# Altium project modFOC-ESC.PrjPcb
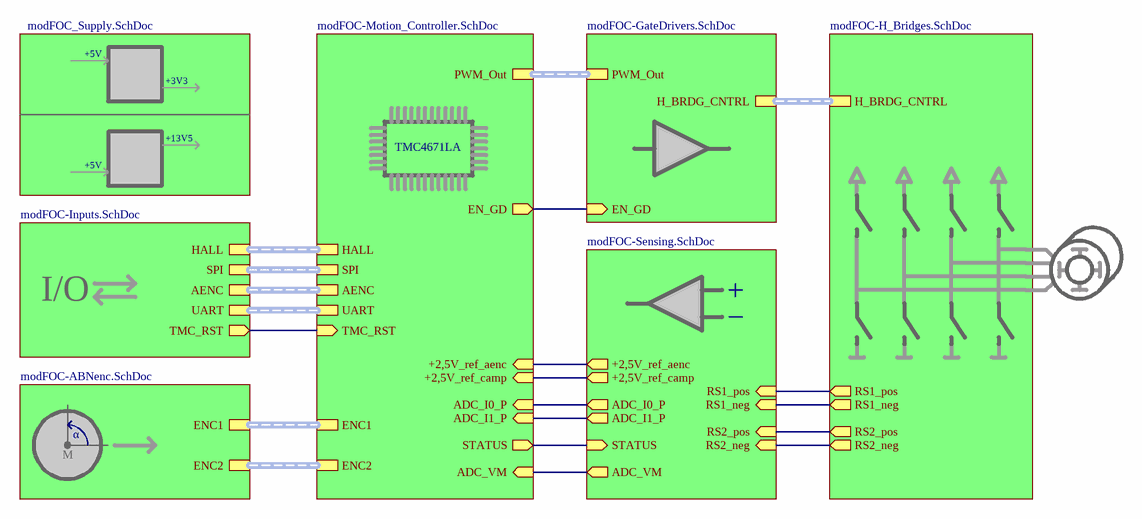
[diagram p0: modFOC-Main.SchDoc]
8 sheets, 184 parts. Net scope: hierarchical (ports join the sheet entries above them; power ports are global).
Board file: modFOC_ESC.PcbDoc
Sheets:
  modFOC-Main.SchDoc
    Motion_Controller = modFOC-Motion_Controller.SchDoc
    GateDrivers = modFOC-GateDrivers.SchDoc
    H_Bridges = modFOC-H_Bridges.SchDoc
    Inputs = modFOC-Inputs.SchDoc
    Sensing = modFOC-Sensing.SchDoc
    ABNenc = modFOC-ABNenc.SchDoc
    Supply = modFOC_Supply.SchDoc

## Sheet modFOC-Main.SchDoc: modFOC-Top
size A4; Author: Mathias Giller; CompanyName: HTL St. Pölten; Address1: modFOC; DocumentNumber: 0; Revision: 2.0; SheetNumber: 0; SheetTotal: 6

### Sub-sheets
ABNenc = modFOC-ABNenc.SchDoc: ENC1 (harness ENC1), ENC2 (harness ENC2)
GateDrivers = modFOC-GateDrivers.SchDoc: PWM_Out (harness PWM_Out), H_BRDG_CNTRL (harness H_BRDG_CNTRL), EN_GD (in)
H_Bridges = modFOC-H_Bridges.SchDoc: RS1_pos (out), RS1_neg (out), RS2_pos (out), RS2_neg (out), H_BRDG_CNTRL (harness H_BRDG_CNTRL)
Inputs = modFOC-Inputs.SchDoc: HALL (harness HALL), SPI (harness SPI), AENC (harness AENC), UART (harness UART), TMC_RST (out)
Motion_Controller = modFOC-Motion_Controller.SchDoc: PWM_Out (harness PWM_Out), ADC_I0_P (in), ADC_I1_P (in), STATUS (out), ADC_VM (in), SPI (harness SPI), UART (harness UART), +2,5V_ref_camp (in), HALL (harness HALL), ENC1 (harness ENC1), AENC (harness AENC), ENC2 (harness ENC2), EN_GD (out), TMC_RST (in), +2,5V_ref_aenc (in)
Sensing = modFOC-Sensing.SchDoc: ADC_I1_P (out), STATUS (in), RS2_neg (in), +2,5V_ref_camp (out), ADC_I0_P (out), RS2_pos (in), RS1_neg (in), ADC_VM (out), RS1_pos (in), +2,5V_ref_aenc (out)
Supply = modFOC_Supply.SchDoc: no entries

### Nets
+2,5V_ref_aenc: sheet Motion_Controller/+2,5V_ref_aenc, sheet Sensing/+2,5V_ref_aenc
+2,5V_ref_camp: sheet Motion_Controller/+2,5V_ref_camp, sheet Sensing/+2,5V_ref_camp
ADC_I0_P: sheet Motion_Controller/ADC_I0_P, sheet Sensing/ADC_I0_P
ADC_I1_P: sheet Motion_Controller/ADC_I1_P, sheet Sensing/ADC_I1_P
ADC_VM: sheet Motion_Controller/ADC_VM, sheet Sensing/ADC_VM
EN_GD: sheet Motion_Controller/EN_GD, sheet GateDrivers/EN_GD
RS1_neg: sheet H_Bridges/RS1_neg, sheet Sensing/RS1_neg
RS1_pos: sheet H_Bridges/RS1_pos, sheet Sensing/RS1_pos
RS2_neg: sheet H_Bridges/RS2_neg, sheet Sensing/RS2_neg
RS2_pos: sheet H_Bridges/RS2_pos, sheet Sensing/RS2_pos
STATUS: sheet Motion_Controller/STATUS, sheet Sensing/STATUS
TMC_RST: sheet Motion_Controller/TMC_RST, sheet Inputs/TMC_RST

### Buses and harness runs
harness sheet ABNenc/ENC1 = sheet Motion_Controller/ENC1
harness sheet ABNenc/ENC2 = sheet Motion_Controller/ENC2
harness sheet GateDrivers/H_BRDG_CNTRL = sheet H_Bridges/H_BRDG_CNTRL
harness sheet GateDrivers/PWM_Out = sheet Motion_Controller/PWM_Out
harness sheet Inputs/AENC = sheet Motion_Controller/AENC
harness sheet Inputs/HALL = sheet Motion_Controller/HALL
harness sheet Inputs/SPI = sheet Motion_Controller/SPI
harness sheet Inputs/UART = sheet Motion_Controller/UART

### Notes on the sheet
- +5V
- +3V3
- +13V5
- TMC4671LA
- I/O
- M
- α
- Title
- Size:
- Date:
- A4
- Number:
- Time:
- Revision:
- Sheet
- of
- File:

## Sheet modFOC-Motion_Controller.SchDoc: modFOC-Motion_Controller
size A4; Date: dssd; Author: Mathias Giller; CompanyName: HTL St. Pölten; Address1: modFOC; DocumentNumber: 1; Revision: 2.0; SheetNumber: 1; SheetTotal: 5
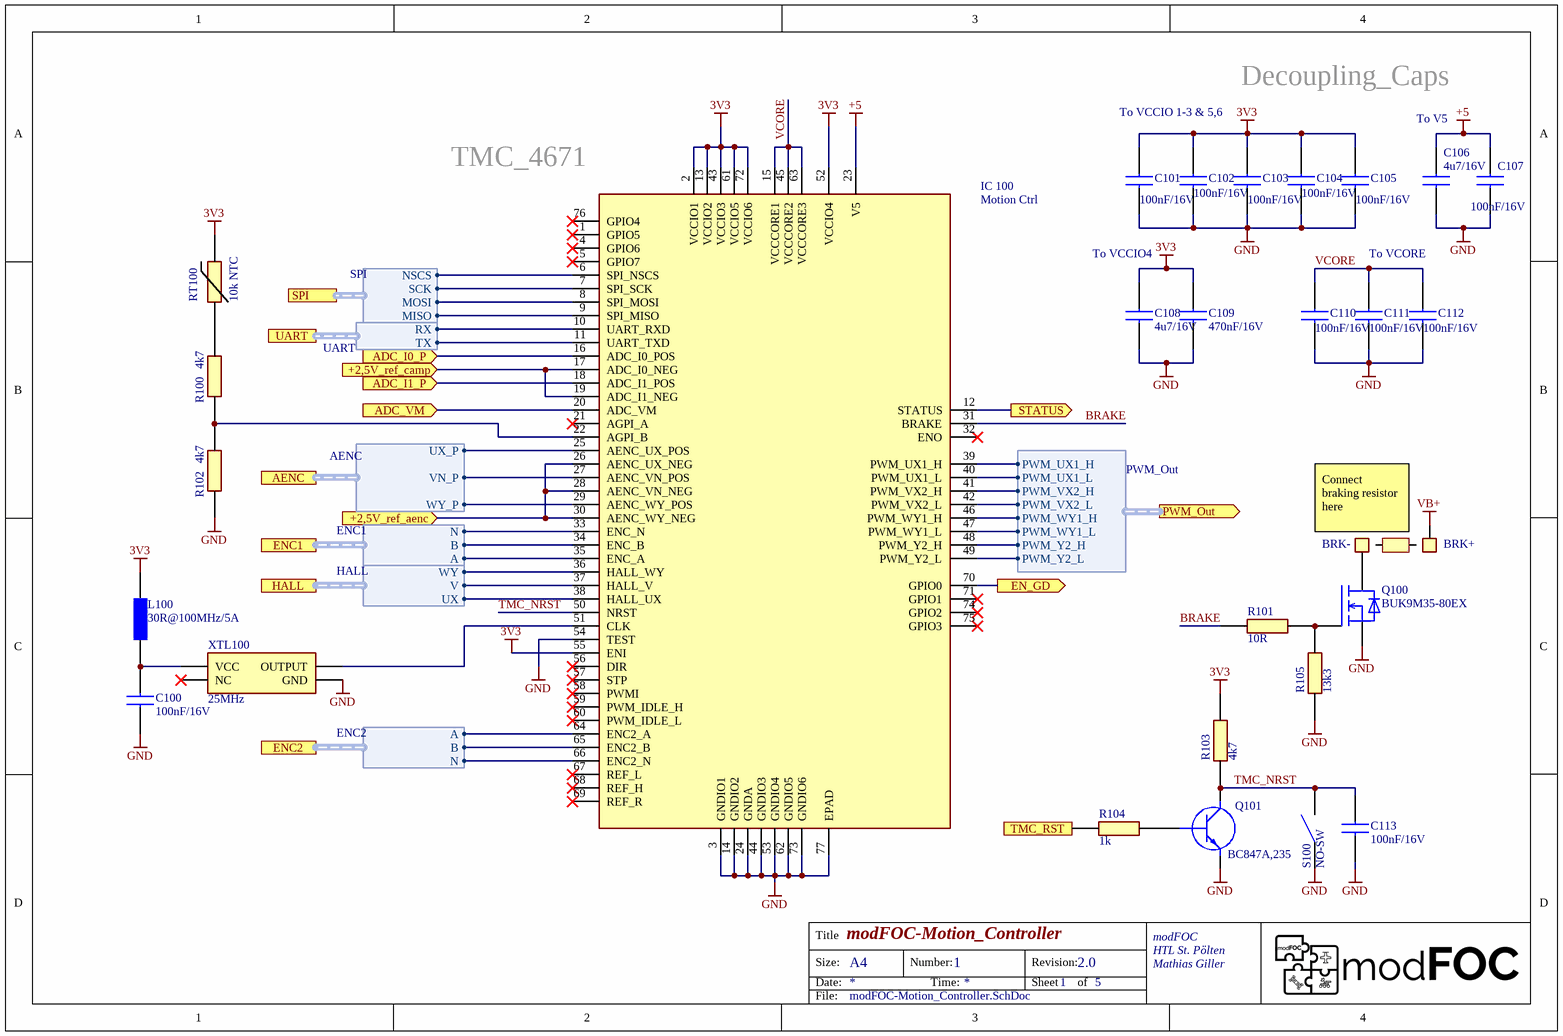
[diagram p1: modFOC-Motion_Controller.SchDoc]

### Parts
BRK+  PW_PAD_SMOL  [PW_PAD_SMOL]  (value not drawn)
BRK-  PW_PAD_SMOL  [PW_PAD_SMOL]  (value not drawn)
C100  100nF/16V  [CAPC1608X97N]
C101  100nF/16V  [CAPC1608X97N]
C102  100nF/16V  [CAPC1608X97N]
C103  100nF/16V  [CAPC1608X97N]
C104  100nF/16V  [CAPC1608X97N]
C105  100nF/16V  [CAPC1608X97N]
C106  4u7/16V  [CAPC1608X97N]
C107  100nF/16V  [CAPC1608X97N]
C108  4u7/16V  [CAPC1608X97N]
C109  470nF/16V  [CAPC1608X97N]
C110  100nF/16V  [CAPC1608X97N]
C111  100nF/16V  [CAPC1608X97N]
C112  100nF/16V  [CAPC1608X97N]
C113  100nF/16V  [CAPC1608X97N]
IC_100  Motion Ctrl  [QFN40P1050X650X90-77N]
L100  30R@100MHz/5A  [BLM18KG101TH1D]
Q100  BUK9M35-80EX  [BUK7M1260E]
Q101  BC847A,235  [SOT95P230X110-3N]
R100  4k7  [RESC1608X55N]
R101  10R  [RESC1608X55N]
R102  4k7  [RESC1608X55N]
R103  4k7  [RESC1608X55N]
R104  1k  [RESC1608X55N]
R105  13k3  [RESC1608X55N]
RT100  10k NTC  [THRMC1608X95N]
S100  NO-SW  [PTS647SM50SMTR2LFS]
XTL100  25MHz  [FOX924B25]

### Ports
+2,5V_ref_aenc (in), +2,5V_ref_camp (in), ADC_I0_P (in), ADC_I1_P (in), ADC_VM (in), AENC (harness AENC), EN_GD (out), ENC1 (harness ENC1), ENC2 (harness ENC2), HALL (harness HALL), PWM_Out (out, harness PWM_Out), SPI (harness SPI), STATUS (out), TMC_RST (in), UART (harness UART)

### Harnesses
PWM_Out: PWM_UX1_H, PWM_UX1_L, PWM_VX2_H, PWM_VX2_L, PWM_WY1_H, PWM_WY1_L, PWM_Y2_H, PWM_Y2_L
UART: RX, TX
AENC: UX_P, VN_P, WY_P
ENC1: N, B, A
HALL: WY, V, UX
ENC2: A, B, N
SPI: NSCS, SCK, MOSI, MISO

### Nets
3V3: C101.2 C102.2 C103.2 C104.2 C105.2 C108.2 C109.1 IC_100.2(VCCIO1) IC_100.13(VCCIO2) IC_100.43(VCCIO3) IC_100.52(VCCIO4) IC_100.55(ENI) IC_100.61(VCCIO5) IC_100.72(VCCIO6) L100.1 R103.2 RT100.1
+5: C106.2 C107.1 IC_100.23(V5)
GND: C100.1 C101.1 C102.1 C103.1 C104.1 C105.1 C106.1 C107.2 C108.1 C109.2 C110.2 C111.2 C112.2 C113.1 IC_100.3(GNDIO1) IC_100.14(GNDIO2) IC_100.24(GNDA) IC_100.44(GNDIO3) IC_100.53(GNDIO4) IC_100.54(TEST) IC_100.62(GNDIO5) IC_100.73(GNDIO6) IC_100.77(EPAD) Q100.1,2,3(S) Q101.2(E) R102.1 R105.2 S100.1,2 XTL100.2(GND)
VB+: BRK+.1
+2,5V_ref_aenc: IC_100.26(AENC_UX_NEG) IC_100.28(AENC_VN_NEG) IC_100.30(AENC_WY_NEG) ; port +2,5V_ref_aenc
+2,5V_ref_camp: IC_100.17(ADC_I0_NEG) IC_100.19(ADC_I1_NEG) ; port +2,5V_ref_camp
ADC_I0_P: IC_100.16(ADC_I0_POS) ; port ADC_I0_P
ADC_I1_P: IC_100.18(ADC_I1_POS) ; port ADC_I1_P
ADC_VM: IC_100.20(ADC_VM) ; port ADC_VM
BRAKE: IC_100.31(BRAKE) R101.1
EN_GD: IC_100.70(GPIO0) ; port EN_GD
SPI.MISO: IC_100.9(SPI_MISO) ; port SPI.MISO
SPI.MOSI: IC_100.8(SPI_MOSI) ; port SPI.MOSI
SPI.SCK: IC_100.7(SPI_SCK) ; port SPI.SCK
STATUS: IC_100.12(STATUS) ; port STATUS
TMC_NRST: C113.2 IC_100.50(NRST) Q101.3(C) R103.1 S100.3,4
TMC_RST: R104.2 ; port TMC_RST
UART.RX: IC_100.10(UART_RXD) ; port UART.RX
VCORE: C110.1 C111.1 C112.1 IC_100.15(VCCCORE1) IC_100.45(VCCCORE2) IC_100.63(VCCCORE3)
NetBRK-_1: BRK-.1 Q100.5,6,7,8,9(D)
NetC100_2: C100.2 L100.2 XTL100.4(VCC)
NetD203_1: IC_100.27(AENC_VN_POS) ; port AENC.VN_P
NetD203_3: IC_100.25(AENC_UX_POS) ; port AENC.UX_P
NetD203_4: IC_100.11(UART_TXD) ; port UART.TX
NetD203_6: IC_100.29(AENC_WY_POS) ; port AENC.WY_P
NetIC200_2: IC_100.38(HALL_UX) ; port HALL.UX
NetIC200_5: IC_100.37(HALL_V) ; port HALL.V
NetIC200_7: IC_100.36(HALL_WY) ; port HALL.WY
NetIC202_3: IC_100.6(SPI_NSCS) ; port SPI.NSCS
NetIC300_2: IC_100.33(ENC_N) ; port ENC1.N
NetIC300_5: IC_100.34(ENC_B) ; port ENC1.B
NetIC300_7: IC_100.35(ENC_A) ; port ENC1.A
NetIC301_2: IC_100.66(ENC2_N) ; port ENC2.N
NetIC301_5: IC_100.65(ENC2_B) ; port ENC2.B
NetIC301_7: IC_100.64(ENC2_A) ; port ENC2.A
NetIC500_7: IC_100.39(PWM_UX1_H) ; port PWM_Out.PWM_UX1_H
NetIC500_8: IC_100.40(PWM_UX1_L) ; port PWM_Out.PWM_UX1_L
NetIC501_7: IC_100.41(PWM_VX2_H) ; port PWM_Out.PWM_VX2_H
NetIC501_8: IC_100.42(PWM_VX2_L) ; port PWM_Out.PWM_VX2_L
NetIC502_7: IC_100.46(PWM_WY1_H) ; port PWM_Out.PWM_WY1_H
NetIC502_8: IC_100.47(PWM_WY1_L) ; port PWM_Out.PWM_WY1_L
NetIC503_7: IC_100.48(PWM_Y2_H) ; port PWM_Out.PWM_Y2_H
NetIC503_8: IC_100.49(PWM_Y2_L) ; port PWM_Out.PWM_Y2_L
NetIC_100_22: IC_100.22(AGPI_B) R100.1 R102.2
NetIC_100_51: IC_100.51(CLK) XTL100.3(OUTPUT)
NetQ100_4: Q100.4(G) R101.2 R105.1
NetQ101_1: Q101.1(B) R104.1
NetR100_2: R100.2 RT100.2

Not connected (* = marked no-connect by the designer): IC_100 1(GPIO5)* 4(GPIO6)* 5(GPIO7)* 21(AGPI_A)* 32(ENO)* 56(DIR)* 57(STP)* 58(PWMI)* 59(PWM_IDLE_H)* 60(PWM_IDLE_L)* 67(REF_L)* 68(REF_H)* 69(REF_R)* 71(GPIO1)* 74(GPIO2)* 75(GPIO3)* 76(GPIO4)*; XTL100 1(NC)*

### Notes on the sheet
- To VCCIO 1-3 & 5,6
- Decoupling_Caps
- (near IC_100) TMC_4671
- To V5
- To VCCIO4
- To VCORE
- Connect
  braking resistor
  here
- Title
- Size:
- Date:
- A4
- Number:
- Time:
- Revision:
- Sheet
- of
- File:

### Library data of the parts
C100-C113 = C0603: Capacitor
IC_100 = TMC4671-LA IC: FOC Motion Controller; Manufacturer_Name: Trinamic; Manufacturer_Part_Number: TMC4671-LA
L100 = BLM18KG300TH1D: Ferrite Bead; Manufacturer_Name: Murata Electronics; Datasheet Link: https://www.murata.com/en-us/products/productdetail?partno=BLM18KG300TH1%23; Height: 0.75mm; Manufacturer_Part_Number: BLM18KG300TH1D; Arrow Part Number: BLM18KG300TH1D; Arrow Price/Stock: https://www.arrow.com/en/products/blm18kg300th1d/murata-manufacturing; Mouser Part Number: 81-BLM18KG300TH1D; Mouser Price/Stock: https://www.mouser.com/Search/Refine.aspx?Keyword=81-BLM18KG300TH1D
Q100 = BUK9M35-80EX: MOSFET (N-Channel); Manufacturer_Name: Nexperia; Datasheet Link: https://assets.nexperia.com/documents/data-sheet/BUK9M35-80E.pdf; Manufacturer_Part_Number: BUK9M35-80EX; Mouser Part Number: 771-BUK9M35-80EX; Mouser Price/Stock: https://www.mouser.com/Search/Refine.aspx?Keyword=771-BUK9M35-80EX; Arrow Part Number: BUK9M35-80EX; Arrow Price/Stock: https://www.arrow.com/en/products/buk9m35-80ex/nexperia
Q101 = BC847A,235: Transistor BJT NPN; Manufacturer_Name: Nexperia; Datasheet Link: http://assets.nexperia.com/documents/data-sheet/BC847_SER.pdf; Height: 1.1mm; Manufacturer_Part_Number: BC847A,235; Mouser Part Number: 771-BC847A235; Mouser Price/Stock: https://www.mouser.co.uk/ProductDetail/Nexperia/BC847A235?qs=me8TqzrmIYWeD%252BqPzufrRA%3D%3D; Arrow Part Number: BC847A,235; Arrow Price/Stock: https://www.arrow.com/en/products/bc847a235/nexperia
R100-R105 = R0603: Resistor
RT100 = NCP18XH103F03RB: Thermistor; Manufacturer_Name: Murata Electronics; Datasheet Link: https://componentsearchengine.com/Datasheets/2/NCP18XH103F03RB.pdf; Height: 0.95mm; Manufacturer_Part_Number: NCP18XH103F03RB; Mouser Part Number: 81-NCP18XH103F03RB; Mouser Price/Stock: https://www.mouser.co.uk/ProductDetail/Murata-Electronics/NCP18XH103F03RB?qs=k3rQb2PKXqkF9YvF09qsvw%3D%3D; Arrow Part Number: NCP18XH103F03RB; Arrow Price/Stock: https://www.arrow.com/en/products/ncp18xh103f03rb/murata-manufacturing?region=europe
S100 = PTS647SM50SMTR2LFS: Switch; Manufacturer_Name: C & K COMPONENTS; Datasheet Link: https://www.ckswitches.com/media/2567/pts647.pdf; Height: 5.25mm; Manufacturer_Part_Number: PTS647SM50SMTR2LFS; Mouser Part Number: 611-PTS647SM50SMTR2L; Mouser Price/Stock: https://www.mouser.co.uk/ProductDetail/CK/PTS647SM50SMTR2LFS?qs=PqoDHHvF64%252BjK4ZB7f42kw%3D%3D; Arrow Part Number: PTS647SM50SMTR2LFS; Arrow Price/Stock: https://www.arrow.com/en/products/pts-647-sm50-smtr2-lfs/ck?region=nac
XTL100 = FOX924B-25: 25Mhz Oscillator; Manufacturer_Name: FOX; Manufacturer_Part_Number: FOX924B-25

## Sheet modFOC-GateDrivers.SchDoc: modFOC-GateDrivers
size A4; Author: Mathias Giller; CompanyName: HTL St. Pölten; Address1: modFOC; DocumentNumber: 5; Revision: 2.0; SheetNumber: 5; SheetTotal: 7
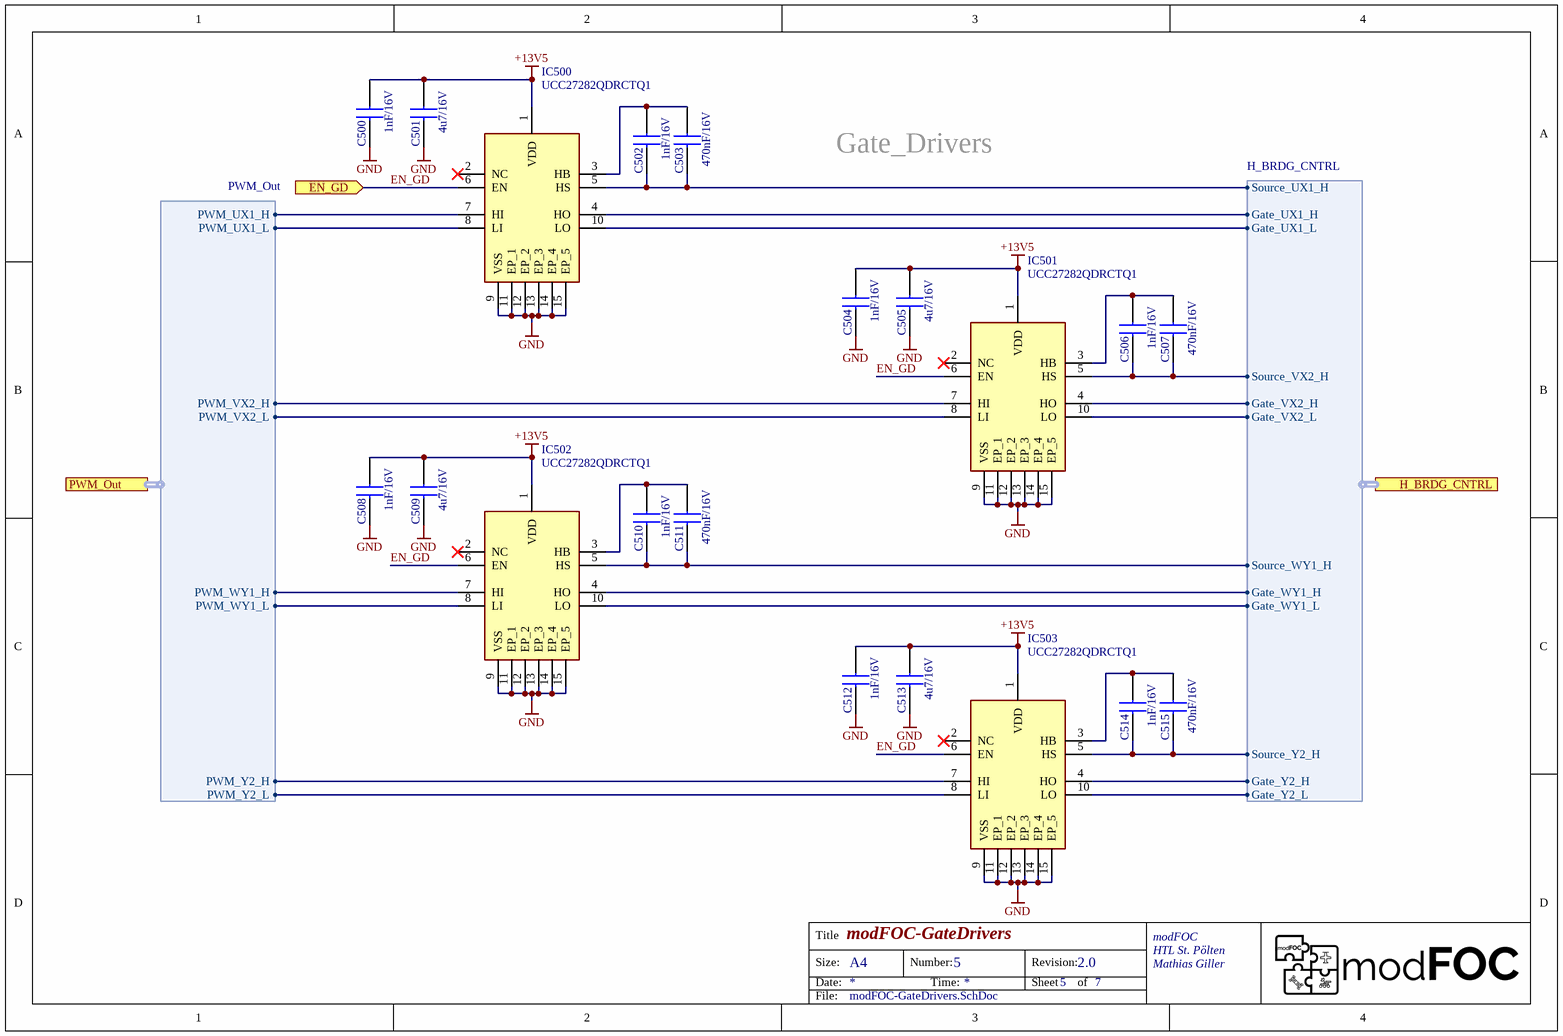
[diagram p2: modFOC-GateDrivers.SchDoc]

### Parts
C500  1nF/16V  [CAPC1608X97N]
C501  4u7/16V  [CAPC1608X97N]
C502  1nF/16V  [CAPC1608X97N]
C503  470nF/16V  [CAPC1608X97N]
C504  1nF/16V  [CAPC1608X97N]
C505  4u7/16V  [CAPC1608X97N]
C506  1nF/16V  [CAPC1608X97N]
C507  470nF/16V  [CAPC1608X97N]
C508  1nF/16V  [CAPC1608X97N]
C509  4u7/16V  [CAPC1608X97N]
C510  1nF/16V  [CAPC1608X97N]
C511  470nF/16V  [CAPC1608X97N]
C512  1nF/16V  [CAPC1608X97N]
C513  4u7/16V  [CAPC1608X97N]
C514  1nF/16V  [CAPC1608X97N]
C515  470nF/16V  [CAPC1608X97N]
IC500  UCC27282QDRCTQ1  [UCC27282DRCR]
IC501  UCC27282QDRCTQ1  [UCC27282DRCR]
IC502  UCC27282QDRCTQ1  [UCC27282DRCR]
IC503  UCC27282QDRCTQ1  [UCC27282DRCR]

### Ports
EN_GD (in), H_BRDG_CNTRL (harness H_BRDG_CNTRL), PWM_Out (harness PWM_Out)

### Harnesses
PWM_Out: PWM_UX1_H, PWM_UX1_L, PWM_VX2_H, PWM_VX2_L, PWM_WY1_H, PWM_WY1_L, PWM_Y2_L, PWM_Y2_H
H_BRDG_CNTRL: Gate_UX1_H, Source_UX1_H, Gate_UX1_L, Source_VX2_H, Gate_VX2_H, Gate_VX2_L, Source_WY1_H, Gate_WY1_H, Gate_WY1_L, Source_Y2_H, Gate_Y2_H, Gate_Y2_L

### Nets
+13V5: C500.2 C501.2 C504.2 C505.2 C508.2 C509.2 C512.2 C513.2 IC500.1(VDD) IC501.1(VDD) IC502.1(VDD) IC503.1(VDD)
GND: C500.1 C501.1 C504.1 C505.1 C508.1 C509.1 C512.1 C513.1 IC500.9(VSS) IC500.11(EP_1) IC500.12(EP_2) IC500.13(EP_3) IC500.14(EP_4) IC500.15(EP_5) IC501.9(VSS) IC501.11(EP_1) IC501.12(EP_2) IC501.13(EP_3) IC501.14(EP_4) IC501.15(EP_5) IC502.9(VSS) IC502.11(EP_1) IC502.12(EP_2) IC502.13(EP_3) IC502.14(EP_4) IC502.15(EP_5) IC503.9(VSS) IC503.11(EP_1) IC503.12(EP_2) IC503.13(EP_3) IC503.14(EP_4) IC503.15(EP_5)
EN_GD: IC500.6(EN) IC501.6(EN) IC502.6(EN) IC503.6(EN) ; port EN_GD
NetC502_1: C502.1 C503.1 IC500.5(HS) ; port H_BRDG_CNTRL.Source_UX1_H
NetC502_2: C502.2 C503.2 IC500.3(HB)
NetC506_1: C506.1 C507.1 IC501.5(HS) ; port H_BRDG_CNTRL.Source_VX2_H
NetC506_2: C506.2 C507.2 IC501.3(HB)
NetC510_1: C510.1 C511.1 IC502.5(HS) ; port H_BRDG_CNTRL.Source_WY1_H
NetC510_2: C510.2 C511.2 IC502.3(HB)
NetC514_1: C514.1 C515.1 IC503.5(HS) ; port H_BRDG_CNTRL.Source_Y2_H
NetC514_2: C514.2 C515.2 IC503.3(HB)
NetIC500_4: IC500.4(HO) ; port H_BRDG_CNTRL.Gate_UX1_H
NetIC500_7: IC500.7(HI) ; port PWM_Out.PWM_UX1_H
NetIC500_8: IC500.8(LI) ; port PWM_Out.PWM_UX1_L
NetIC500_10: IC500.10(LO) ; port H_BRDG_CNTRL.Gate_UX1_L
NetIC501_4: IC501.4(HO) ; port H_BRDG_CNTRL.Gate_VX2_H
NetIC501_7: IC501.7(HI) ; port PWM_Out.PWM_VX2_H
NetIC501_8: IC501.8(LI) ; port PWM_Out.PWM_VX2_L
NetIC501_10: IC501.10(LO) ; port H_BRDG_CNTRL.Gate_VX2_L
NetIC502_4: IC502.4(HO) ; port H_BRDG_CNTRL.Gate_WY1_H
NetIC502_7: IC502.7(HI) ; port PWM_Out.PWM_WY1_H
NetIC502_8: IC502.8(LI) ; port PWM_Out.PWM_WY1_L
NetIC502_10: IC502.10(LO) ; port H_BRDG_CNTRL.Gate_WY1_L
NetIC503_4: IC503.4(HO) ; port H_BRDG_CNTRL.Gate_Y2_H
NetIC503_7: IC503.7(HI) ; port PWM_Out.PWM_Y2_H
NetIC503_8: IC503.8(LI) ; port PWM_Out.PWM_Y2_L
NetIC503_10: IC503.10(LO) ; port H_BRDG_CNTRL.Gate_Y2_L

Not connected (* = marked no-connect by the designer): IC500 2(NC)*; IC501 2(NC)*; IC502 2(NC)*; IC503 2(NC)*

### Notes on the sheet
- Gate_Drivers
- Title
- Size:
- Date:
- A4
- Number:
- Time:
- Revision:
- Sheet
- of
- File:

### Library data of the parts
C500-C515 = C0603: Capacitor
IC500-IC503 = UCC27282QDRCTQ1: Halfbridge driver IC; Manufacturer_Name: Texas Instruments; Datasheet Link: https://www.ti.com/lit/ds/symlink/ucc27282.pdf?ts=1615361050656&ref_url=https%253A%252F%252Fwww.ti.com%252Fstore%252Fti%252Fen%252Fp%252Fproduct%252F%253Fp%253DUCC27282DRCR; Height: 1mm; Manufacturer_Part_Number: UCC27282QDRCTQ1; Mouser Part Number: 595-UCC27282DRCR; Mouser Price/Stock: https://www.mouser.co.uk/ProductDetail/Texas-Instruments/UCC27282DRCR?qs=PqoDHHvF64%252BEqc2WJXKXkQ%3D%3D; Arrow Part Number: UCC27282DRCR; Arrow Price/Stock: https://www.arrow.com/en/products/ucc27282drcr/texas-instruments?region=nac

## Sheet modFOC-H_Bridges.SchDoc: modFOC-H-Bridges
size A4; Author: Mathias Giller; CompanyName: HTL St. Pölten; Address1: modFOC; DocumentNumber: 6; Revision: 2.0; SheetNumber: 6; SheetTotal: 7
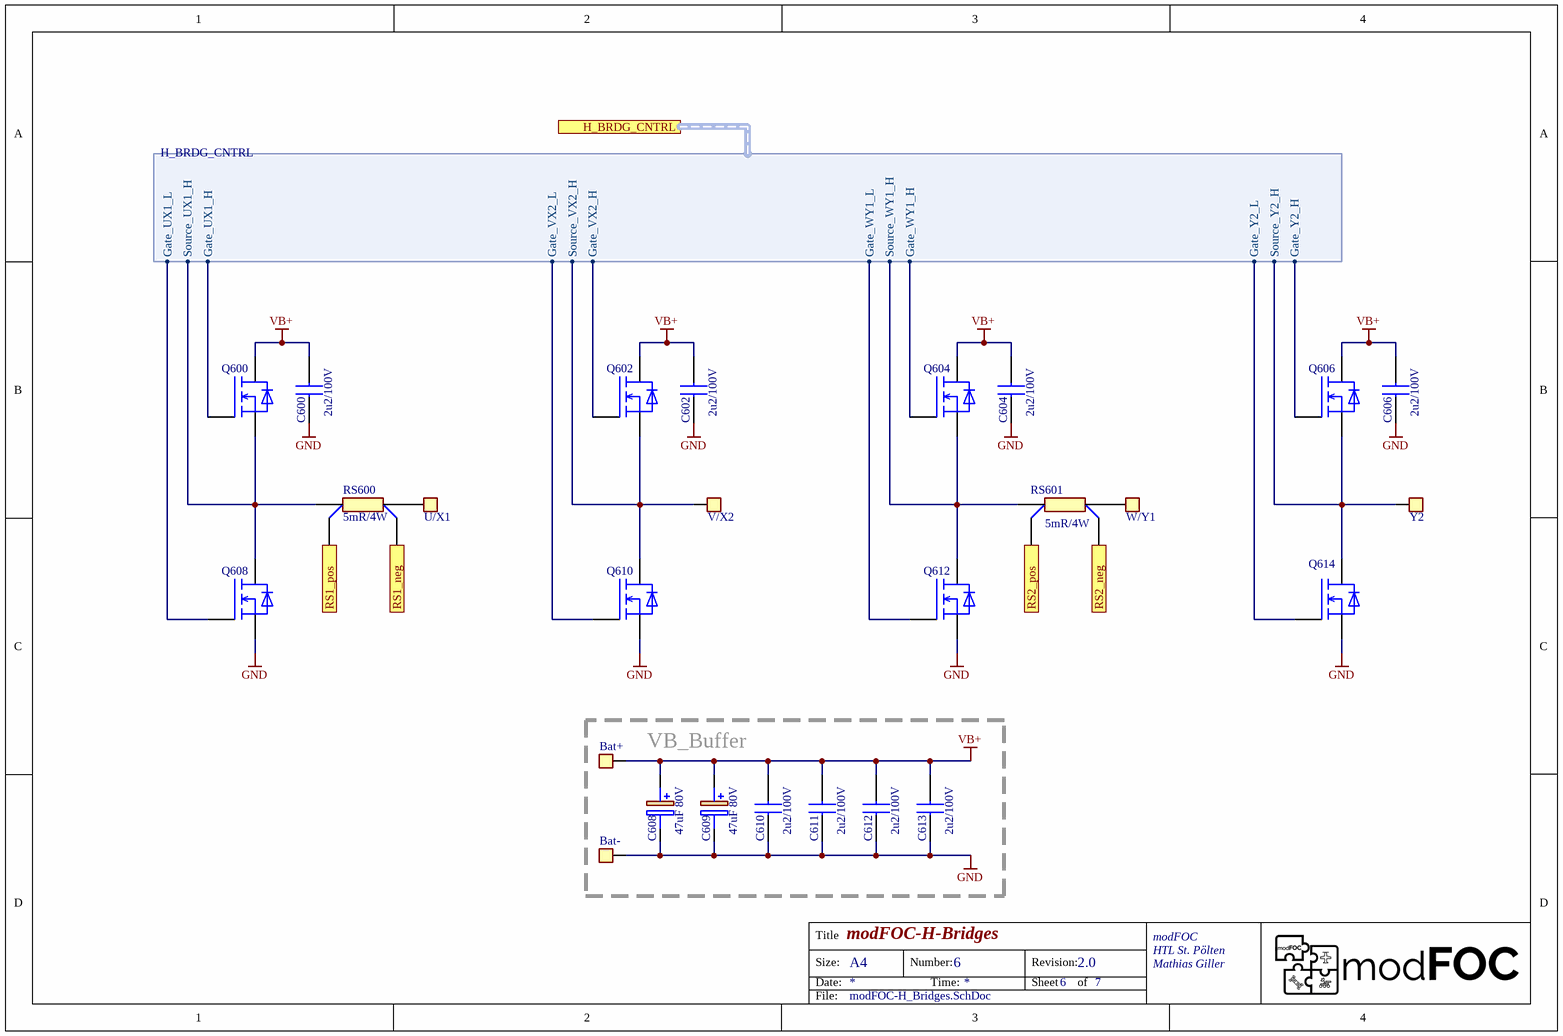
[diagram p3: modFOC-H_Bridges.SchDoc]

### Parts
Bat+  PowerPad  [POWER_PAD]  (value not drawn)
Bat-  PowerPad  [POWER_PAD]  (value not drawn)
C600  2u2/100V  [CAPC3225X280N]
C602  2u2/100V  [CAPC3225X280N]
C604  2u2/100V  [CAPC3225X280N]
C606  2u2/100V  [CAPC3225X280N]
C608  47uF 80V  [CAPAE1050X1050N]
C609  47uF 80V  [CAPAE1050X1050N]
C610  2u2/100V  [CAPC3225X280N]
C611  2u2/100V  [CAPC3225X280N]
C612  2u2/100V  [CAPC3225X280N]
C613  2u2/100V  [CAPC3225X280N]
Q600  80V/100A  [SI7141DPT1GE3]  (value not drawn)
Q602  80V/100A  [SI7141DPT1GE3]  (value not drawn)
Q604  80V/100A  [SI7141DPT1GE3]  (value not drawn)
Q606  80V/100A  [SI7141DPT1GE3]  (value not drawn)
Q608  80V/100A  [SI7141DPT1GE3]  (value not drawn)
Q610  80V/100A  [SI7141DPT1GE3]  (value not drawn)
Q612  80V/100A  [SI7141DPT1GE3]  (value not drawn)
Q614  80V/100A  [SI7141DPT1GE3]  (value not drawn)
RS600  5mR/4W  [FC4L90R025FER]
RS601  5mR/4W  [FC4L90R025FER]
U/X1  PowerPad  [POWER_PAD]  (value not drawn)
V/X2  PowerPad  [POWER_PAD]  (value not drawn)
W/Y1  PowerPad  [POWER_PAD]  (value not drawn)
Y2  PowerPad  [POWER_PAD]  (value not drawn)

### Blocks framed on the sheet
VB_Buffer: Bat+ Bat- C608-C613

### Ports
H_BRDG_CNTRL (harness H_BRDG_CNTRL), RS1_neg (out), RS1_pos (out), RS2_neg (out), RS2_pos (out)

### Harnesses
H_BRDG_CNTRL: Gate_UX1_H, Source_UX1_H, Gate_UX1_L, Source_VX2_H, Gate_VX2_H, Gate_VX2_L, Source_WY1_H, Gate_WY1_H, Gate_WY1_L, Source_Y2_H, Gate_Y2_H, Gate_Y2_L

### Nets
GND: Bat-.1 C600.1 C602.1 C604.1 C606.1 C608.2(-) C609.2(-) C610.1 C611.1 C612.1 C613.1 Q608.1,2,3(S) Q610.1,2,3(S) Q612.1,2,3(S) Q614.1,2,3(S)
VB+: Bat+.1 C600.2 C602.2 C604.2 C606.2 C608.1(+) C609.1(+) C610.2 C611.2 C612.2 C613.2 Q600.11,10,9,8,7,6,5(D) Q602.11,10,9,8,7,6,5(D) Q604.11,10,9,8,7,6,5(D) Q606.11,10,9,8,7,6,5(D)
RS1_neg: RS600.1(K1) ; port RS1_neg
RS1_pos: RS600.4(K2) ; port RS1_pos
RS2_neg: RS601.4(K2) ; port RS2_neg
RS2_pos: RS601.1(K1) ; port RS2_pos
NetC502_1: Q600.1,2,3(S) Q608.11,10,9,8,7,6,5(D) RS600.3(P2) ; port H_BRDG_CNTRL.Source_UX1_H
NetC506_1: Q602.1,2,3(S) Q610.11,10,9,8,7,6,5(D) V/X2.1 ; port H_BRDG_CNTRL.Source_VX2_H
NetC510_1: Q604.1,2,3(S) Q612.11,10,9,8,7,6,5(D) RS601.2(P1) ; port H_BRDG_CNTRL.Source_WY1_H
NetC514_1: Q606.1,2,3(S) Q614.11,10,9,8,7,6,5(D) Y2.1 ; port H_BRDG_CNTRL.Source_Y2_H
NetIC500_4: Q600.4(G) ; port H_BRDG_CNTRL.Gate_UX1_H
NetIC500_10: Q608.4(G) ; port H_BRDG_CNTRL.Gate_UX1_L
NetIC501_4: Q602.4(G) ; port H_BRDG_CNTRL.Gate_VX2_H
NetIC501_10: Q610.4(G) ; port H_BRDG_CNTRL.Gate_VX2_L
NetIC502_4: Q604.4(G) ; port H_BRDG_CNTRL.Gate_WY1_H
NetIC502_10: Q612.4(G) ; port H_BRDG_CNTRL.Gate_WY1_L
NetIC503_4: Q606.4(G) ; port H_BRDG_CNTRL.Gate_Y2_H
NetIC503_10: Q614.4(G) ; port H_BRDG_CNTRL.Gate_Y2_L
NetRS600_2: RS600.2(P1) U/X1.1
NetRS601_3: RS601.3(P2) W/Y1.1

### Notes on the sheet
- Title
- Size:
- Date:
- A4
- Number:
- Time:
- Revision:
- Sheet
- of
- File:

### Library data of the parts
C600 C602 C604 C606 C610-C613 = C1210: Capacitor
C608 C609 = MAL215097701E3: ELKO 10x10x10; Manufacturer_Name: Vishay; Datasheet Link: https://www.vishay.com/docs/28395/150crz.pdf; Height: 10.5mm; Manufacturer_Part_Number: MAL215097701E3; Mouser Part Number: 594-MAL215097701E3; Mouser Price/Stock: https://www.mouser.co.uk/ProductDetail/Vishay-BC-Components/MAL215097701E3?qs=bKenfurwlsnF8zBng3kToA%3D%3D
Q600 Q602 Q604 Q606 Q608 Q610 Q612 Q614 = SIR680DP-T1-RE3: MOSFET (N-Channel); Manufacturer_Name: Vishay; Datasheet Link: https://www.vishay.com/docs/75267/sir680dp.pdf; Height: 1.12mm; Manufacturer_Part_Number: SIR680DP-T1-RE3; Mouser Part Number: 78-SIR680DP-T1-RE3; Mouser Price/Stock: https://www.mouser.co.uk/ProductDetail/Vishay-Siliconix/SIR680DP-T1-RE3?qs=Mv7BduZupUi1ZFscSbHz5g%3D%3D; Arrow Part Number: SIR680DP-T1-RE3; Arrow Price/Stock: https://www.arrow.com/en/products/sir680dp-t1-re3/vishay
RS600 RS601 = FC4L90R025FER: Resistor; Manufacturer_Name: Ohmite; Datasheet Link: https://componentsearchengine.com/Datasheets/1/FC4L90R025FER.pdf; Height: 0.8mm; Manufacturer_Part_Number: FC4L90R025FER; Mouser Part Number: 588-FC4L90R025FER; Mouser Price/Stock: https://www.mouser.co.uk/ProductDetail/Ohmite/FC4L90R025FER?qs=lc2O%252BfHJPVauiFLZwCqH8Q%3D%3D

## Sheet modFOC-Inputs.SchDoc: modFOC-Inputs
size A4; Author: Mathias Giller; CompanyName: HTL St. Pölten; Address1: modFOC; DocumentNumber: 2; Revision: 2.0; SheetNumber: 2; SheetTotal: 7
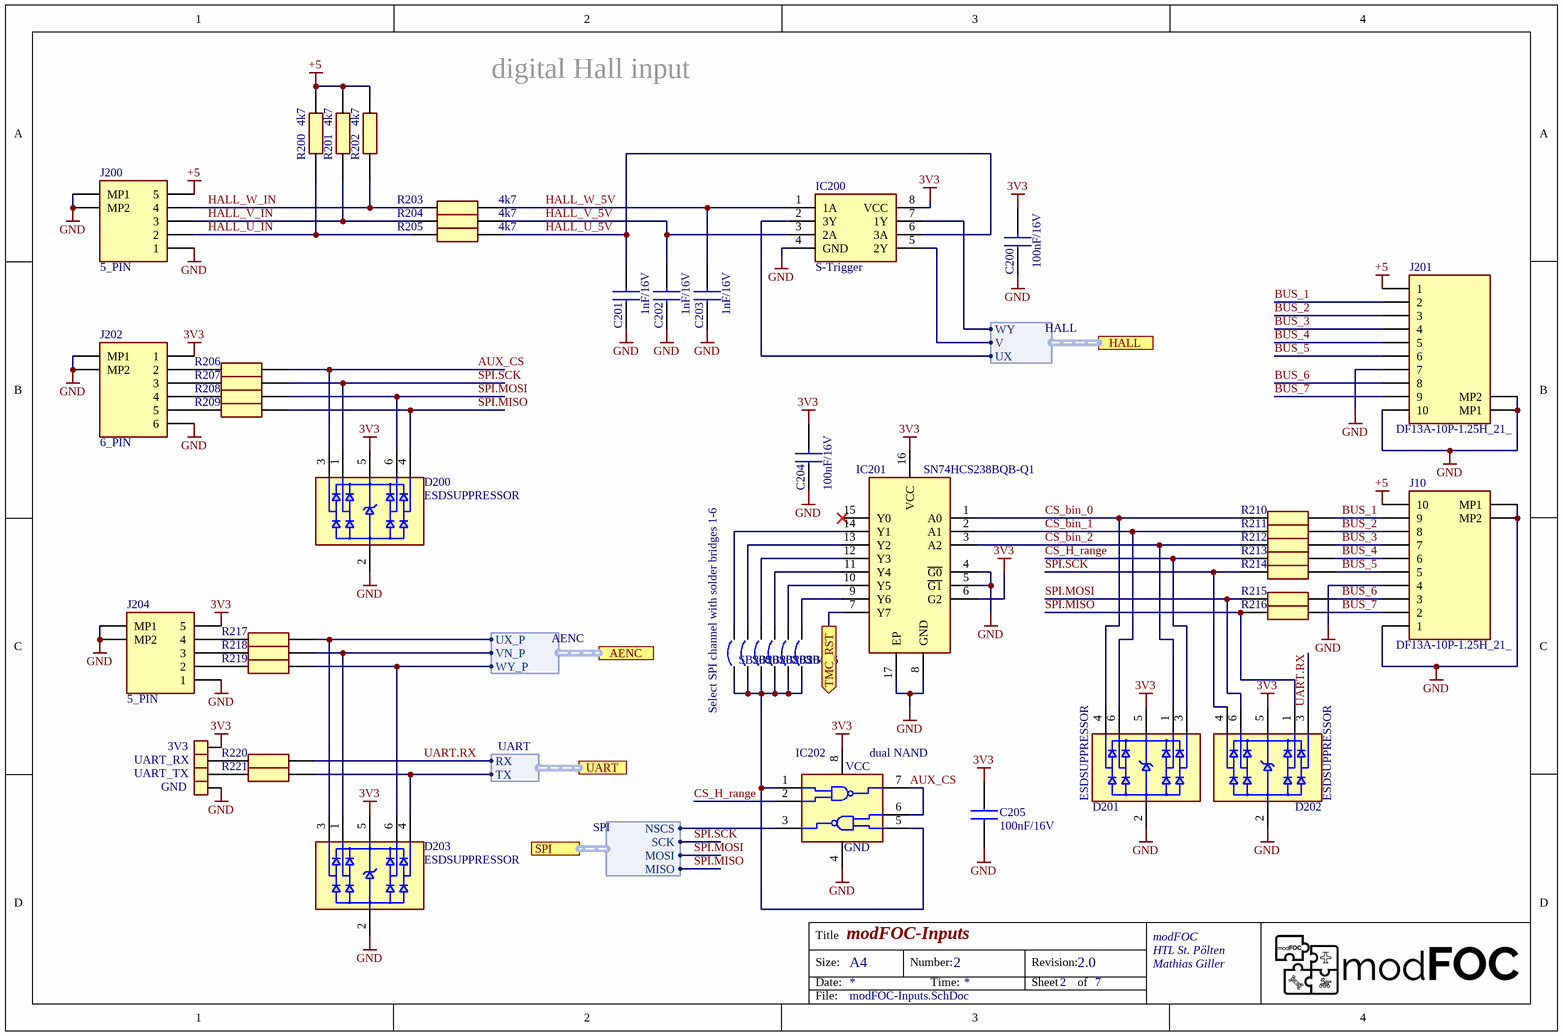
[diagram p4: modFOC-Inputs.SchDoc]

### Parts
C200  100nF/16V  [CAPC1608X97N]
C201  1nF/16V  [CAPC1608X97N]
C202  1nF/16V  [CAPC1608X97N]
C203  1nF/16V  [CAPC1608X97N]
C204  100nF/16V  [CAPC1608X97N]
C205  100nF/16V  [CAPC1608X97N]
D200  ESDSUPPRESSOR  [SOT23-6]
D201  ESDSUPPRESSOR  [SOT23-6]
D202  ESDSUPPRESSOR  [SOT23-6]
D203  ESDSUPPRESSOR  [SOT23-6]
IC200  S-Trigger  [SOP65P400X110-8N]
IC201  SN74HCS238BQB-Q1  [SN74HCS238BQB-Q1]
IC202  dual NAND  [74AUP1G74GF115]
J10  DF13A-10P-1.25H_21_  [DF13A10P125H21]
J200  5_PIN  [DF13A5P125H21]
J201  DF13A-10P-1.25H_21_  [DF13A10P125H21]
J202  6_PIN  [DF13A6P125H21]
J204  5_PIN  [DF13A5P125H21]
J205  3V3  [Pin]
J206  UART_RX  [Pin]
J207  UART_TX  [Pin]
J208  GND  [Pin]
R200  4k7  [RESC1608X55N]
R201  4k7  [RESC1608X55N]
R202  4k7  [RESC1608X55N]
R203  4k7  [RESC1608X55N]
R204  4k7  [RESC1608X55N]
R205  4k7  [RESC1608X55N]
R206  100R  [RESC1005X40N]  (value not drawn)
R207  100R  [RESC1005X40N]  (value not drawn)
R208  100R  [RESC1005X40N]  (value not drawn)
R209  100R  [RESC1005X40N]  (value not drawn)
R210  100R  [RESC1005X40N]  (value not drawn)
R211  100R  [RESC1005X40N]  (value not drawn)
R212  100R  [RESC1005X40N]  (value not drawn)
R213  100R  [RESC1005X40N]  (value not drawn)
R214  100R  [RESC1005X40N]  (value not drawn)
R215  100R  [RESC1005X40N]  (value not drawn)
R216  100R  [RESC1005X40N]  (value not drawn)
R217  100R  [RESC1005X40N]  (value not drawn)
R218  100R  [RESC1005X40N]  (value not drawn)
R219  100R  [RESC1005X40N]  (value not drawn)
R220  100R  [RESC1005X40N]  (value not drawn)
R221  100R  [RESC1005X40N]  (value not drawn)
SB200  Solder Bridge  [SOLDER-BRIDGE_R0603-0R]  (value not drawn)
SB201  Solder Bridge  [SOLDER-BRIDGE_R0603-0R]  (value not drawn)
SB202  Solder Bridge  [SOLDER-BRIDGE_R0603-0R]  (value not drawn)
SB203  Solder Bridge  [SOLDER-BRIDGE_R0603-0R]  (value not drawn)
SB204  Solder Bridge  [SOLDER-BRIDGE_R0603-0R]  (value not drawn)
SB205  Solder Bridge  [SOLDER-BRIDGE_R0603-0R]  (value not drawn)

### Ports
AENC (harness AENC), HALL (harness HALL), SPI (harness SPI), TMC_RST (out), UART (harness UART)

### Harnesses
UART: RX, TX
SPI: NSCS, SCK, MOSI, MISO
AENC: UX_P, VN_P, WY_P
HALL: WY, V, UX

### Nets
3V3: C200.2 C204.1 C205.1 D200.5(VDD) D201.5(VDD) D202.5(VDD) D203.5(VDD) IC200.8(VCC) IC201.6(G2) IC201.16(VCC) IC202.8 J202.1 J204.5 J205.1
+5: J10.10 J200.5 J201.1 R200.2 R201.2 R202.2
GND: C200.1 C201.2 C202.2 C203.2 C204.2 C205.2 D200.2(GND) D201.2(GND) D202.2(GND) D203.2(GND) IC200.4(GND) IC201.4(~{G0}) IC201.5(~{G1}) IC201.8(GND) IC201.17(EP) IC202.4 J10.1 J10.4 J10.MP1 J10.MP2 J200.1 J200.MP1 J200.MP2 J201.7 J201.10 J201.MP1 J201.MP2 J202.6 J202.MP1 J202.MP2 J204.1 J204.MP1 J204.MP2 J208.1
AUX_CS: D200.3(CH1) IC202.6(2B) IC202.7(1Y) R206.2
BUS_1: J10.9 J201.2 R210.2
BUS_2: J10.8 J201.3 R211.2
BUS_3: J10.7 J201.4 R212.2
BUS_4: J10.6 J201.5 R213.2
BUS_5: J10.5 J201.6 R214.2
BUS_6: J10.3 J201.8 R215.2
BUS_7: J10.2 J201.9 R216.2
CS_bin_0: D201.4(CH3) IC201.1(A0) R210.1
CS_bin_1: D201.6(CH2) IC201.2(A1) R211.1
CS_bin_2: D201.1(CH4) IC201.3(A2) R212.1
CS_H_range: D201.3(CH1) IC202.2(1B) R213.1
HALL_U_5V: C201.1 IC200.6(3A) R205.1
HALL_U_IN: J200.2 R200.1 R205.2
HALL_V_5V: C202.1 IC200.3(2A) R204.1
HALL_V_IN: J200.3 R201.1 R204.2
HALL_W_5V: C203.1 IC200.1(1A) R203.1
HALL_W_IN: J200.4 R202.1 R203.2
SPI.MISO: D200.4(CH3) D202.1(CH4) R209.2 R216.1 ; port SPI.MISO
SPI.MOSI: D200.6(CH2) D202.6(CH2) R208.2 R215.1 ; port SPI.MOSI
SPI.SCK: D200.1(CH4) D202.4(CH3) R207.2 R214.1 ; port SPI.SCK
TMC_RST: IC201.7(Y7) ; port TMC_RST
UART.RX: D202.3(CH1) R220.2 ; port UART.RX
NetD203_1: D203.1(CH4) R218.2 ; port AENC.VN_P
NetD203_3: D203.3(CH1) R217.2 ; port AENC.UX_P
NetD203_4: D203.4(CH3) R221.2 ; port UART.TX
NetD203_6: D203.6(CH2) R219.2 ; port AENC.WY_P
NetIC200_2: IC200.2(3Y) ; port HALL.UX
NetIC200_5: IC200.5(2Y) ; port HALL.V
NetIC200_7: IC200.7(1Y) ; port HALL.WY
NetIC201_9: IC201.9(Y6) SB205.2
NetIC201_10: IC201.10(Y5) SB204.2
NetIC201_11: IC201.11(Y4) SB203.2
NetIC201_12: IC201.12(Y3) SB202.2
NetIC201_13: IC201.13(Y2) SB201.2
NetIC201_14: IC201.14(Y1) SB200.2
NetIC202_1: IC202.1(1A) IC202.5(2A) SB200.1 SB201.1 SB202.1 SB203.1 SB204.1 SB205.1
NetIC202_3: IC202.3(2Y) ; port SPI.NSCS
NetJ202_2: J202.2 R206.1
NetJ202_3: J202.3 R207.1
NetJ202_4: J202.4 R208.1
NetJ202_5: J202.5 R209.1
NetJ204_2: J204.2 R219.1
NetJ204_3: J204.3 R218.1
NetJ204_4: J204.4 R217.1
NetJ206_1: J206.1 R220.1
NetJ207_1: J207.1 R221.1

Not connected (* = marked no-connect by the designer): IC201 15(Y0)*

### Notes on the sheet
- digital Hall input
- (near SB200) Select SPI channel with solder bridges 1-6
- Title
- Size:
- Date:
- A4
- Number:
- Time:
- Revision:
- Sheet
- of
- File:
- (in symbol 74AUP2G132GF,115) VCC; GND

### Library data of the parts
C200-C205 = C0603: Capacitor
D200-D203 = ESDSUPPRESSOR: TVS Diode (Uni-directional); Datasheet Link: *; Height: 0.6mm; Manufacturer_Name: *; Manufacturer_Part_Number: *; Mauser_Part_Number: *
IC200 = 74LVC3G17DP,125: 3x Schmitt trigger; Manufacturer_Name: Nexperia; Datasheet Link: https://assets.nexperia.com/documents/data-sheet/74LVC3G17.pdf; Height: 1.1mm; Manufacturer_Part_Number: 74LVC3G17DP,125; Mouser Part Number: 771-LVC3G17DP125; Mouser Price/Stock: https://www.mouser.co.uk/ProductDetail/Nexperia/74LVC3G17DP125?qs=me8TqzrmIYUUngWcw0uHGA%3D%3D; Arrow Part Number: 74LVC3G17DP,125; Arrow Price/Stock: https://www.arrow.com/en/products/74lvc3g17dp125/nexperia
IC201 = SN74HCS238BQB-Q1: 3bit bin to dec noninverting; Manufacturer_Name: Texas Instruments; Manufacturer_Part_Number: SN74HCS238QBQBRQ1; Datasheet Link: https://www.ti.com/lit/gpn/SN74HCS238-Q1; Height: 0.8mm; Mouser Part Number: 595-N74HCS238QBQBRQ1
IC202 = 74AUP2G132GF,115: Dual triple input NAND; Manufacturer_Name: Nexperia; Datasheet Link: https://assets.nexperia.com/documents/data-sheet/74AUP2G132.pdf; Manufacturer_Part_Number: 74AUP2G132GF,115; Mouser Part Number: 771-74AUP2G132GF115; Mouser Price/Stock: https://www.mouser.co.uk/ProductDetail/Nexperia/74AUP2G132GF115?qs=jquClx72t9AzfoBXotQVdg%3D%3D
J10 J201 = DF13A-10P-1.25H_21_: 10Pin DF13 Connector; Manufacturer_Name: Hirose; Manufacturer_Part_Number: DF13A-10P-1.25H(21); Datasheet Link: https://datasheet.datasheetarchive.com/originals/dk/DKDS-30/590349.pdf; Height: 3.75mm; Mouser Part Number: 798-DF13A10P125H21; Mouser Price/Stock: https://www.mouser.co.uk/ProductDetail/Hirose-Connector/DF13A-10P-125H21?qs=XQjbzJWzFPV7pEVOeMnY%2FQ%3D%3D; Arrow Part Number: DF13A-10P-1.25H(21); Arrow Price/Stock: https://www.arrow.com/en/products/df13a-10p-1.25h-21/hirose-electric
J200 J204 = DF13A-5P-1.25H_21_: Connector; Manufacturer_Name: Hirose; Manufacturer_Part_Number: DF13A-5P-1.25H(21); Datasheet Link: https://componentsearchengine.com/Datasheets/1/DF13A-5P-1.25H(21).pdf; Height: 3.75mm; Mouser Part Number: 798-DF13A5P125H21; Mouser Price/Stock: https://www.mouser.co.uk/ProductDetail/Hirose-Connector/DF13A-5P-125H21?qs=XQjbzJWzFPWvJsE2o%252B4Q8Q%3D%3D
J202 = DF13A-6P-1.25H_21_: 6 Pin DF13 Connector; Manufacturer_Name: Hirose; Manufacturer_Part_Number: DF13A-6P-1.25H(21); Datasheet Link: https://www.hirose.com/product/download/?distributor=digikey&type=2d&lang=en&num=DF13A-6P-1.25H(21); Height: 3.75mm; Mouser Part Number: 798-DF13A6P125H21; Mouser Price/Stock: https://www.mouser.co.uk/ProductDetail/Hirose-Connector/DF13A-6P-125H21?qs=XQjbzJWzFPXnreVi%252BPl0Lg%3D%3D; Arrow Part Number: DF13A-6P-1.25H(21); Arrow Price/Stock: https://www.arrow.com/en/products/df13a-6p-1.25h-21/hirose-electric
J205-J208 = Pin
R200-R205 = R0603: Resistor
R206-R221 = R0402: Resistor; Height: 0.4mm
SB200-SB205 = Solder Bridge: Internal_Part_Number: MCD-00071; Part_Type: Mechanical; Manufacturer_Part_Number: RC0603JR-070RL; Manufacturer: YAGEO; Provided_By: SUBCO; ECCN_US: n/a; ECCN_EU: n/a; Status: Released; Package: SB0603; ComponentLink1Description: Datasheet; ComponentLink1URL: http://tunmcdsvn.tun.st.com/Component_Datasheet_Library/Trunk/Resistors/Yageo_Resistor_RC0603-series

## Sheet modFOC-Sensing.SchDoc: modFOC-Sensing
size A4; Author: Mathias Giller; CompanyName: HTL St. Pölten; Address1: modFOC; DocumentNumber: 4; Revision: 2.0; SheetNumber: 4; SheetTotal: 7
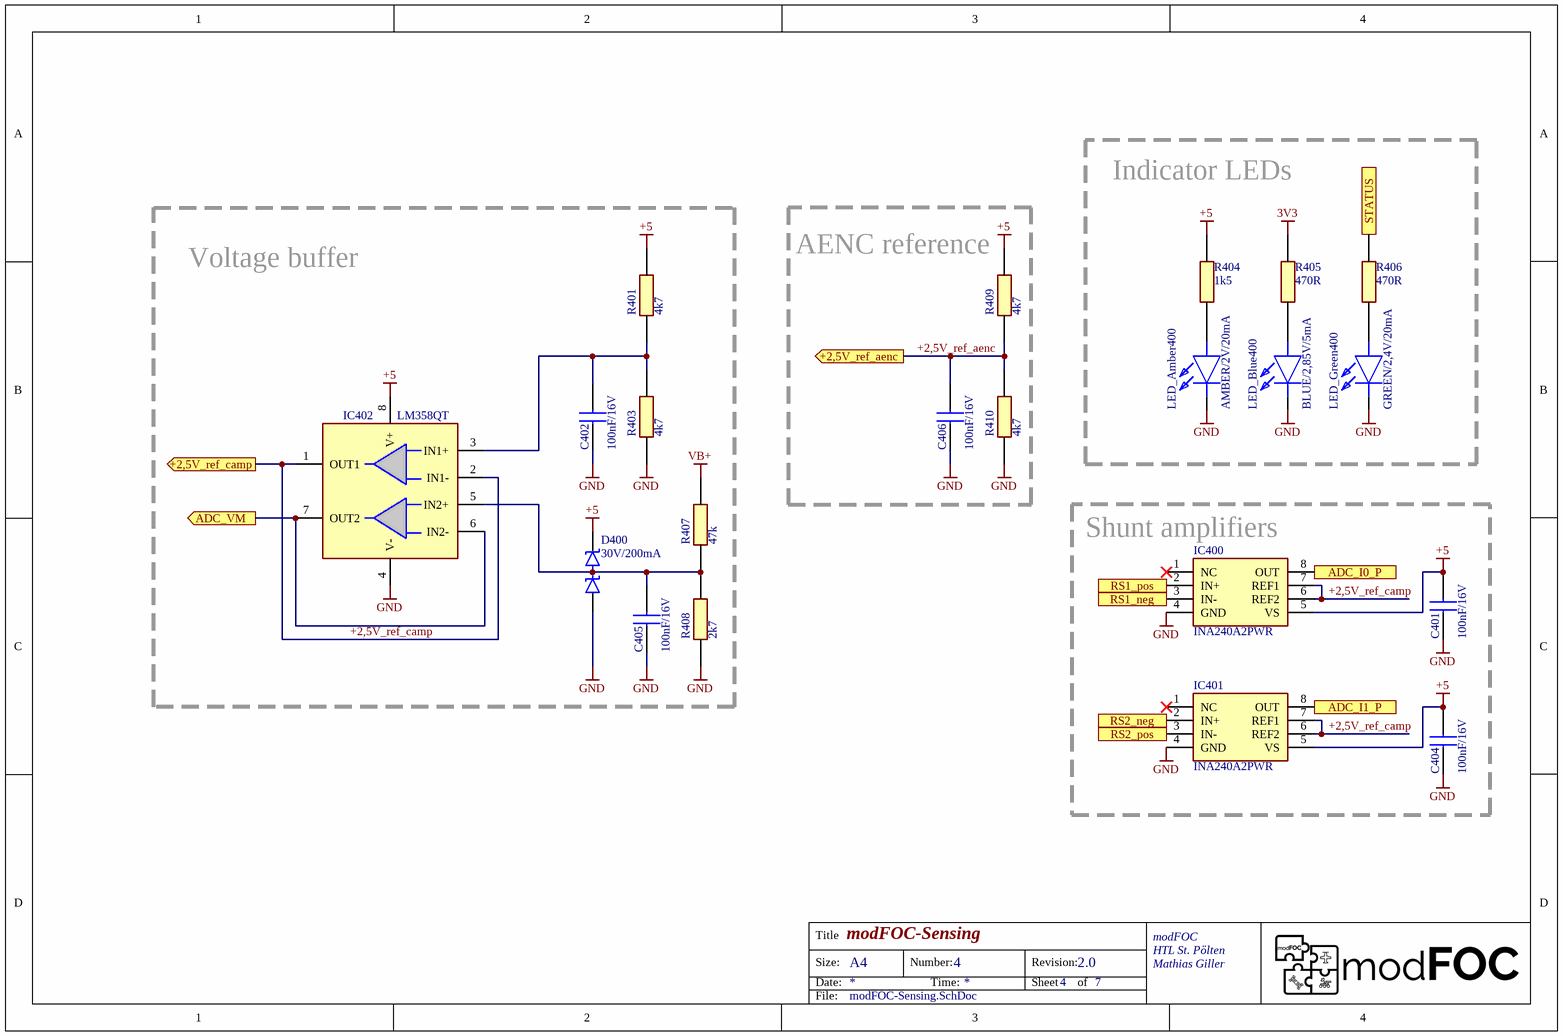
[diagram p5: modFOC-Sensing.SchDoc]

### Parts
C401  100nF/16V  [CAPC1608X97N]
C402  100nF/16V  [CAPC1608X97N]
C404  100nF/16V  [CAPC1608X97N]
C405  100nF/16V  [CAPC1608X97N]
C406  100nF/16V  [CAPC1608X97N]
D400  30V/200mA  [SOT95P240X110-3N]
IC400  INA240A2PWR  [SOP65P640X120-8N]
IC401  INA240A2PWR  [SOP65P640X120-8N]
IC402  LM358QT  [SON50P200X200X60-9N-D]
LED_Amber400  AMBER/2V/20mA  [LEDC1608X55N]
LED_Blue400  BLUE/2,85V/5mA  [LEDC1608X40N]
LED_Green400  GREEN/2,4V/20mA  [LGQ396PS35]
R401  4k7  [RESC1608X55N]
R403  4k7  [RESC1608X55N]
R404  1k5  [RESC1608X55N]
R405  470R  [RESC1608X55N]
R406  470R  [RESC1608X55N]
R407  47k  [RESC1608X55N]
R408  2k7  [RESC1608X55N]
R409  4k7  [RESC1608X55N]
R410  4k7  [RESC1608X55N]

### Blocks framed on the sheet
Indicator LEDs: LED_Amber400 LED_Blue400 LED_Green400 R404-R406
Voltage buffer: C402 C405 D400 IC402 R401 R403 R407 R408
AENC reference: C406 R409 R410
Shunt amplifiers: C401 C404 IC400 IC401

### Ports
+2,5V_ref_aenc (out), +2,5V_ref_camp (out), ADC_I0_P (out), ADC_I1_P (out), ADC_VM (out), RS1_neg (in), RS1_pos (in), RS2_neg (in), RS2_pos (in), STATUS (in)

### Nets
3V3: R405.1
+5: C401.2 C404.2 D400.2(K) IC400.5(VS) IC401.5(VS) IC402.8(V+) R401.2 R404.1 R409.2
GND: C401.1 C402.1 C404.1 C405.1 C406.1 D400.1(A) IC400.4(GND) IC401.4(GND) IC402.4(V-) LED_Amber400.1(K) LED_Blue400.1(K) LED_Green400.1(K) R403.1 R408.2 R410.1
VB+: R407.1
+2,5V_ref_aenc: C406.2 R409.1 R410.2 ; port +2,5V_ref_aenc
+2,5V_ref_camp: IC400.6(REF2) IC400.7(REF1) IC401.6(REF2) IC401.7(REF1) IC402.1(OUT1) IC402.2(IN1-) ; port +2,5V_ref_camp
ADC_I0_P: IC400.8(OUT) ; port ADC_I0_P
ADC_I1_P: IC401.8(OUT) ; port ADC_I1_P
ADC_VM: IC402.6(IN2-) IC402.7(OUT2) ; port ADC_VM
RS1_neg: IC400.3(IN-) ; port RS1_neg
RS1_pos: IC400.2(IN+) ; port RS1_pos
RS2_neg: IC401.2(IN+) ; port RS2_neg
RS2_pos: IC401.3(IN-) ; port RS2_pos
STATUS: R406.1 ; port STATUS
NetC402_2: C402.2 IC402.3(IN1+) R401.1 R403.2
NetC405_2: C405.2 D400.3(A/K) IC402.5(IN2+) R407.2 R408.1
NetLED_Amber400_2: LED_Amber400.2(A) R404.2
NetLED_Blue400_2: LED_Blue400.2(A) R405.2
NetLED_Green400_2: LED_Green400.2(A) R406.2

Not connected (* = marked no-connect by the designer): IC400 1(NC)*; IC401 1(NC)*

### Notes on the sheet
- (near IC400) Inputs inverted to aid PCB layout
- Title
- Size:
- Date:
- A4
- Number:
- Time:
- Revision:
- Sheet
- of
- File:

### Library data of the parts
C401 C402 C404-C406 = C0603: Capacitor
D400 = BAT54S: Schottky Diode; Manufacturer_Name: Rectron; Datasheet Link: https://www.rectron.com/data_sheets/bat54s.pdf; Height: 1.1mm; Manufacturer_Part_Number: BAT54S; Mouser Part Number: 583-BAT54S; Mouser Price/Stock: https://www.mouser.co.uk/ProductDetail/Rectron/BAT54S?qs=7pEAo90IqNGRiqD7TkybWA%3D%3D; Arrow Part Number: BAT54S; Arrow Price/Stock: https://www.arrow.com/en/products/bat54s/rectron
IC400 IC401 = INA240A2PWR: Current shunt amp; Manufacturer_Name: Texas Instruments; Manufacturer_Part_Number: INA240A4PWR; Datasheet Link: http://www.ti.com/lit/ds/symlink/ina240.pdf; Height: 1.2mm; Mouser Part Number: 595-INA240A4PWR; Mouser Price/Stock: https://www.mouser.co.uk/ProductDetail/Texas-Instruments/INA240A4PWR?qs=aVyJF2WnouQ31PAZ9p0r8w%3D%3D; Arrow Part Number: INA240A4PWR; Arrow Price/Stock: https://www.arrow.com/en/products/ina240a4pwr/texas-instruments?region=nac
IC402 = LM358QT: Le' Megaslow 358; Manufacturer_Name: STMicroelectronics; Datasheet Link: https://componentsearchengine.com/Datasheets/1/LM358QT.pdf; Height: 0.6mm; Manufacturer_Part_Number: LM358QT; Mouser Part Number: 511-LM358QT; Mouser Price/Stock: https://www.mouser.co.uk/ProductDetail/STMicroelectronics/LM358QT?qs=GkDVaEP5dcs4xwTXUtddog%3D%3D; Arrow Part Number: LM358QT; Arrow Price/Stock: https://www.arrow.com/en/products/lm358qt/stmicroelectronics?region=nac
LED_Amber400 = ASMT-RA45-AP932: LED; Manufacturer_Name: Avago Technologies; Datasheet Link: https://docs.broadcom.com/docs/AV02-0378EN; Height: 0.55mm; Manufacturer_Part_Number: ASMT-RA45-AP932; Mouser Part Number: 630-ASMT-RA45-AP932; Mouser Price/Stock: https://www.mouser.co.uk/ProductDetail/Broadcom-Avago/ASMT-RA45-AP932?qs=7zQgkplsu%2FO5gZneoB42ug%3D%3D
LED_Blue400 = LB_Q39G-L2OO-35-1: LED; Manufacturer_Name: OSRAM; Manufacturer_Part_Number: LB Q39G-L2OO-35-1; Datasheet Link: http://www.mouser.com/ds/2/311/LB Q39G - CHIPLED 0603-553388.pdf; Height: 0.4mm; Mouser Part Number: 720-LBQ39GL2N2351; Mouser Price/Stock: https://www.mouser.co.uk/ProductDetail/OSRAM-Opto-Semiconductors/LB-Q39G-L2OO-35-1?qs=74fRo9GAWsxvZBH6a5xY%252BA%3D%3D; Arrow Part Number: LB Q39G-L2OO-35-1; Arrow Price/Stock: https://www.arrow.com/en/products/lbq39g-l2oo-35-1/osram-opto-semiconductors
LED_Green400 = LG_Q396-PS-35: LED Green; Manufacturer_Name: OSRAM; Manufacturer_Part_Number: LG Q396-PS-35; Datasheet Link: https://mouser.componentsearchengine.com/Datasheets/2/LG%20Q396-PS-35.pdf; Height: 0.4mm; Mouser Part Number: 720-LGQ396A3964; Mouser Price/Stock: https://www.mouser.co.uk/ProductDetail/OSRAM-Opto-Semiconductors/LG-Q396-PS-35?qs=xC%252BE9h5iuX5%252BCocujXxOpw%3D%3D; Arrow Part Number: LG Q396-PS-35; Arrow Price/Stock: https://www.arrow.com/en/products/lgq396-ps-35/osram-opto-semiconductors
R401 R403-R410 = R0603: Resistor

## Sheet modFOC-ABNenc.SchDoc: modFOC-ABNenc
size A4; Author: Mathias Giller; CompanyName: HTL St. Pölten; Address1: modFOC; DocumentNumber: 3; Revision: 2.0; SheetNumber: 3; SheetTotal: 7
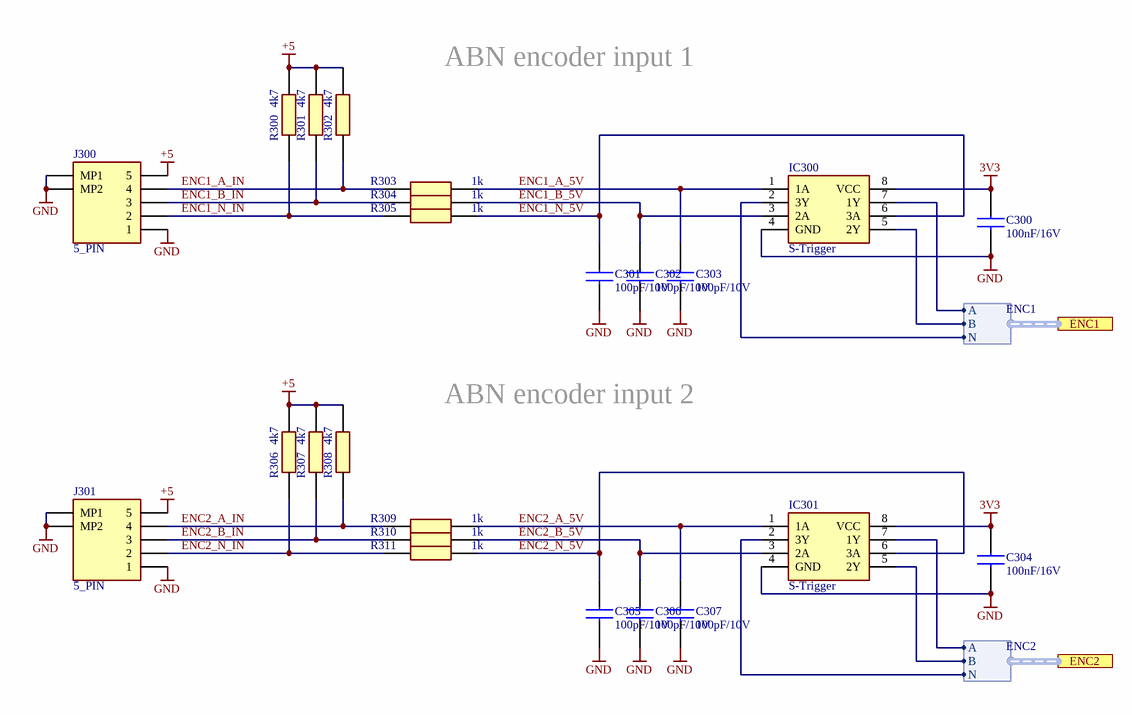
[diagram p6: modFOC-ABNenc.SchDoc]

### Parts
C300  100nF/16V  [CAPC1608X97N]
C301  100pF/10V  [CAPC1608X97N]
C302  100pF/10V  [CAPC1608X97N]
C303  100pF/10V  [CAPC1608X97N]
C304  100nF/16V  [CAPC1608X97N]
C305  100pF/10V  [CAPC1608X97N]
C306  100pF/10V  [CAPC1608X97N]
C307  100pF/10V  [CAPC1608X97N]
IC300  S-Trigger  [SOP65P400X110-8N]
IC301  S-Trigger  [SOP65P400X110-8N]
J300  5_PIN  [DF13A5P125H21]
J301  5_PIN  [DF13A5P125H21]
R300  4k7  [RESC1608X55N]
R301  4k7  [RESC1608X55N]
R302  4k7  [RESC1608X55N]
R303  1k  [RESC1608X55N]
R304  1k  [RESC1608X55N]
R305  1k  [RESC1608X55N]
R306  4k7  [RESC1608X55N]
R307  4k7  [RESC1608X55N]
R308  4k7  [RESC1608X55N]
R309  1k  [RESC1608X55N]
R310  1k  [RESC1608X55N]
R311  1k  [RESC1608X55N]

### Ports
ENC1 (harness ENC1), ENC2 (harness ENC2)

### Harnesses
ENC1: N, B, A
ENC2: A, B, N

### Nets
3V3: C300.2 C304.2 IC300.8(VCC) IC301.8(VCC)
+5: J300.5 J301.5 R300.2 R301.2 R302.2 R306.2 R307.2 R308.2
GND: C300.1 C301.2 C302.2 C303.2 C304.1 C305.2 C306.2 C307.2 IC300.4(GND) IC301.4(GND) J300.1 J300.MP1 J300.MP2 J301.1 J301.MP1 J301.MP2
ENC1_A_5V: C303.1 IC300.1(1A) R303.1
ENC1_A_IN: J300.4 R302.1 R303.2
ENC1_B_5V: C302.1 IC300.3(2A) R304.1
ENC1_B_IN: J300.3 R301.1 R304.2
ENC1_N_5V: C301.1 IC300.6(3A) R305.1
ENC1_N_IN: J300.2 R300.1 R305.2
ENC2_A_5V: C307.1 IC301.1(1A) R309.1
ENC2_A_IN: J301.4 R308.1 R309.2
ENC2_B_5V: C306.1 IC301.3(2A) R310.1
ENC2_B_IN: J301.3 R307.1 R310.2
ENC2_N_5V: C305.1 IC301.6(3A) R311.1
ENC2_N_IN: J301.2 R306.1 R311.2
NetIC300_2: IC300.2(3Y) ; port ENC1.N
NetIC300_5: IC300.5(2Y) ; port ENC1.B
NetIC300_7: IC300.7(1Y) ; port ENC1.A
NetIC301_2: IC301.2(3Y) ; port ENC2.N
NetIC301_5: IC301.5(2Y) ; port ENC2.B
NetIC301_7: IC301.7(1Y) ; port ENC2.A

### Notes on the sheet
- ABN encoder input 1
- ABN encoder input 2
- Title
- Size:
- Date:
- A4
- Number:
- Time:
- Revision:
- Sheet
- of
- File:

### Library data of the parts
C300-C307 = C0603: Capacitor
IC300 IC301 = 74LVC3G17DP,125: as IC200 on sheet modFOC-Inputs; Datasheet Link: https://assets.nexperia.com/documents/data-sheet/74LVC3G17.pdf; Height: 1.1mm; Manufacturer_Part_Number: 74LVC3G17DP,125; Mouser Part Number: 771-LVC3G17DP125; Mouser Price/Stock: https://www.mouser.co.uk/ProductDetail/Nexperia/74LVC3G17DP125?qs=me8TqzrmIYUUngWcw0uHGA%3D%3D; Arrow Part Number: 74LVC3G17DP,125; Arrow Price/Stock: https://www.arrow.com/en/products/74lvc3g17dp125/nexperia
J300 J301 = DF13A-5P-1.25H_21_: as J200 on sheet modFOC-Inputs; Datasheet Link: https://componentsearchengine.com/Datasheets/1/DF13A-5P-1.25H(21).pdf; Height: 3.75mm; Mouser Part Number: 798-DF13A5P125H21; Mouser Price/Stock: https://www.mouser.co.uk/ProductDetail/Hirose-Connector/DF13A-5P-125H21?qs=XQjbzJWzFPWvJsE2o%252B4Q8Q%3D%3D
R300-R311 = R0603: Resistor

## Sheet modFOC_Supply.SchDoc: modFOC-Supply
size A4; Author: Mathias Giller; CompanyName: HTL St. Pölten; Address1: modFOC; DocumentNumber: 7; Revision: 2.0; SheetNumber: 7; SheetTotal: 7
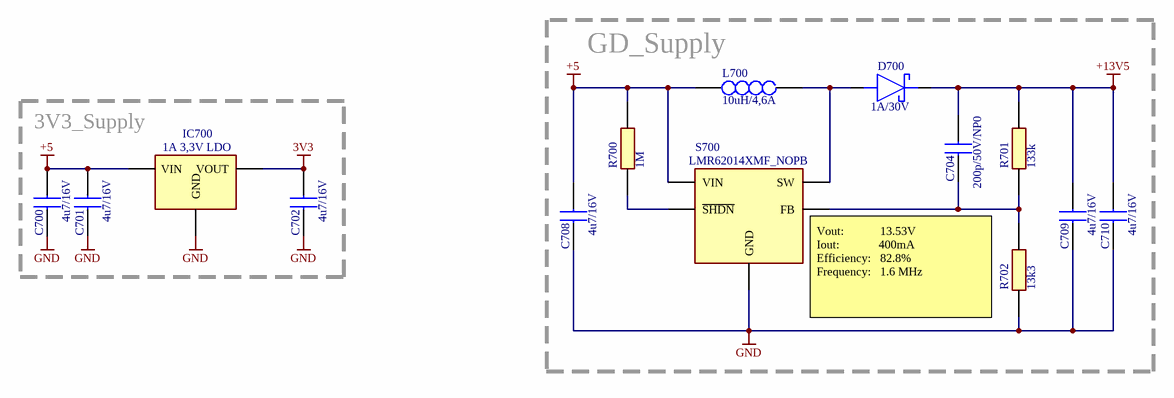
[diagram p7: modFOC_Supply.SchDoc]

### Parts
C700  4u7/16V  [CAPC1608X97N]
C701  4u7/16V  [CAPC1608X97N]
C702  4u7/16V  [CAPC1608X97N]
C704  200p/50V/NP0  [CAPC1608X90N]
C708  4u7/16V  [CAPC1608X97N]
C709  4u7/16V  [CAPC1608X97N]
C710  4u7/16V  [CAPC1608X97N]
D700  1A/30V  [SODFL5226X110N]
IC700  1A 3,3V LDO  [SOT230P700X180-4N]
L700  10uH/4,6A  [74438357100]
R700  1M  [RESC1608X55N]
R701  133k  [RESC1608X55N]
R702  13k3  [RESC1608X55N]
S700  LMR62014XMF_NOPB  [SOT95P280X145-5N]

### Blocks framed on the sheet
GD_Supply: C704 C708-C710 D700 L700 R700-R702 S700
3V3_Supply: C700-C702 IC700

### Nets
3V3: C702.1 IC700.2,4(VOUT)
+5: C700.1 C701.1 C708.1 IC700.3(VIN) L700.1 R700.2 S700.5(VIN)
+13V5: C704.1 C709.1 C710.1 D700.1(K) R701.1
GND: C700.2 C701.2 C702.2 C708.2 C709.2 C710.2 IC700.1(GND) R702.2 S700.2(GND)
NetC704_2: C704.2 R701.2 R702.1 S700.3(FB)
NetD700_2: D700.2(A) L700.2 S700.1(SW)
NetR700_1: R700.1 S700.4(~{SHDN})

### Notes on the sheet
- (near S700) Vout:            13.53V
  Iout:             400mA
  Efficiency:   82.8%
  Frequency:   1.6 MHz
- Title
- Size:
- Date:
- A4
- Number:
- Time:
- Revision:
- Sheet
- of
- File:

### Library data of the parts
C700-C702 C708-C710 = C0603: Capacitor
C704 = GRM1885C1H201JA01D: Capacitor; Manufacturer_Name: Murata Electronics; Datasheet Link: http://www.murata.com/~/media/webrenewal/support/library/catalog/products/capacitor/mlcc/c02e.pdf; Height: 0.9mm; Manufacturer_Part_Number: GRM1885C1H201JA01D; Mouser Part Number: 81-GRM39C201J50; Mouser Price/Stock: https://www.mouser.com/Search/Refine.aspx?Keyword=81-GRM39C201J50
D700 = STPS1L30AFN: Schottky Diode; Manufacturer_Name: STMicroelectronics; Datasheet Link: https://4donline.ihs.com/images/VipMasterIC/IC/SGST/SGST-S-A0009026271/SGST-S-A0009026271-1.pdf?hkey=6D3A4C79FDBF58556ACFDE234799DDF0; Height: 1.1mm; Manufacturer_Part_Number: STPS1L30AFN; Mouser Part Number: 511-STPS1L30AFN; Mouser Price/Stock: https://www.mouser.co.uk/ProductDetail/STMicroelectronics/STPS1L30AFN?qs=Cb2nCFKsA8pl%252BsoFM6iGfw%3D%3D; Arrow Part Number: STPS1L30AFN; Arrow Price/Stock: https://www.arrow.com/en/products/stps1l30afn/stmicroelectronics?region=nac
IC700 = AP2114H-3.3TRG1: 3V3 LDO; Manufacturer_Name: Diodes Inc.; Datasheet Link: http://uk.rs-online.com/web/p/products/8283528; Height: 1.8mm; Manufacturer_Part_Number: AP2114H-3.3TRG1; Arrow Part Number: AP2114H-3.3TRG1; Arrow Price/Stock: https://www.arrow.com/en/products/ap2114h-3.3trg1/diodes-incorporated; Mouser Part Number: 621-AP2114H-3.3TRG1; Mouser Price/Stock: https://www.mouser.co.uk/ProductDetail/Diodes-Incorporated/AP2114H-33TRG1?qs=x6A8l6qLYDDSG%2FfwzcsOhw%3D%3D
L700 = 74438357100: Inductor; Manufacturer_Name: Wurth Elektronik; Datasheet Link: https://katalog.we-online.com/pbs/datasheet/74438357100.pdf; Height: 4mm; Manufacturer_Part_Number: 74438357100; Mouser Part Number: 710-74438357100; Mouser Price/Stock: https://www.mouser.co.uk/ProductDetail/Wurth-Elektronik/74438357100?qs=AQlKX63v8RsOZwIYXNHv7w%3D%3D
R700 = RC0603FR-071ML: Resistor; Manufacturer_Name: YAGEO (PHYCOMP); Datasheet Link: https://www.yageo.com/upload/media/product/productsearch/datasheet/rchip/PYu-RC_Group_51_RoHS_L_11.pdf; Height: 0.55mm; Manufacturer_Part_Number: RC0603FR-071ML; Mouser Part Number: 603-RC0603FR-071ML; Mouser Price/Stock: https://www.mouser.co.uk/ProductDetail/Yageo/RC0603FR-071ML/?qs=VU8sRB4EgwDPceeQKB324w%3D%3D; Arrow Part Number: RC0603FR-071ML; Arrow Price/Stock: https://www.arrow.com/en/products/rc0603fr-071ml/yageo
R701 R702 = R0603: Resistor
S700 = LMR62014XMF_NOPB: Switch; Manufacturer_Name: Texas Instruments; Manufacturer_Part_Number: LMR62014XMF/NOPB; Datasheet Link: http://www.ti.com/lit/gpn/lmr62014; Height: 1.45mm; Mouser Part Number: 926-LMR62014XMF/NOPB; Mouser Price/Stock: https://www.mouser.co.uk/ProductDetail/Texas-Instruments/LMR62014XMF-NOPB?qs=cN01o9PeIQtA177Vn0GXdQ%3D%3D; Arrow Part Number: LMR62014XMF/NOPB; Arrow Price/Stock: https://www.arrow.com/en/products/lmr62014xmfnopb/texas-instruments

## Nets that join several sheets
3V3: modFOC-Motion_Controller (17 pins), modFOC-Inputs (14 pins), modFOC-Sensing (R405.1), modFOC-ABNenc (C300.2 C304.2 IC300.8 IC301.8), modFOC_Supply (C702.1 IC700.2,4)
+5: modFOC-Motion_Controller (C106.2 C107.1 IC_100.23), modFOC-Inputs (6 pins), modFOC-Sensing (9 pins), modFOC-ABNenc (8 pins), modFOC_Supply (7 pins)
+13V5: modFOC-GateDrivers (12 pins), modFOC_Supply (5 pins)
GND: modFOC-Motion_Controller (29 pins), modFOC-GateDrivers (32 pins), modFOC-H_Bridges (15 pins), modFOC-Inputs (34 pins), modFOC-Sensing (15 pins), modFOC-ABNenc (16 pins), modFOC_Supply (9 pins)
VB+: modFOC-Motion_Controller (BRK+.1), modFOC-H_Bridges (15 pins), modFOC-Sensing (R407.1)
+2,5V_ref_aenc: modFOC-Motion_Controller (IC_100.26 IC_100.28 IC_100.30), modFOC-Sensing (C406.2 R409.1 R410.2)
+2,5V_ref_camp: modFOC-Motion_Controller (IC_100.17 IC_100.19), modFOC-Sensing (6 pins)
ADC_I0_P: modFOC-Motion_Controller (IC_100.16), modFOC-Sensing (IC400.8)
ADC_I1_P: modFOC-Motion_Controller (IC_100.18), modFOC-Sensing (IC401.8)
ADC_VM: modFOC-Motion_Controller (IC_100.20), modFOC-Sensing (IC402.6 IC402.7)
EN_GD: modFOC-Motion_Controller (IC_100.70), modFOC-GateDrivers (IC500.6 IC501.6 IC502.6 IC503.6)
NetC502_1: modFOC-GateDrivers (C502.1 C503.1 IC500.5), modFOC-H_Bridges (Q600.1,2,3 Q608.11,10,9,8,7,6,5 RS600.3)
NetC506_1: modFOC-GateDrivers (C506.1 C507.1 IC501.5), modFOC-H_Bridges (Q602.1,2,3 Q610.11,10,9,8,7,6,5 V/X2.1)
NetC510_1: modFOC-GateDrivers (C510.1 C511.1 IC502.5), modFOC-H_Bridges (Q604.1,2,3 Q612.11,10,9,8,7,6,5 RS601.2)
NetC514_1: modFOC-GateDrivers (C514.1 C515.1 IC503.5), modFOC-H_Bridges (Q606.1,2,3 Q614.11,10,9,8,7,6,5 Y2.1)
NetD203_1: modFOC-Motion_Controller (IC_100.27), modFOC-Inputs (D203.1 R218.2)
NetD203_3: modFOC-Motion_Controller (IC_100.25), modFOC-Inputs (D203.3 R217.2)
NetD203_4: modFOC-Motion_Controller (IC_100.11), modFOC-Inputs (D203.4 R221.2)
NetD203_6: modFOC-Motion_Controller (IC_100.29), modFOC-Inputs (D203.6 R219.2)
NetIC200_2: modFOC-Motion_Controller (IC_100.38), modFOC-Inputs (IC200.2)
NetIC200_5: modFOC-Motion_Controller (IC_100.37), modFOC-Inputs (IC200.5)
NetIC200_7: modFOC-Motion_Controller (IC_100.36), modFOC-Inputs (IC200.7)
NetIC202_3: modFOC-Motion_Controller (IC_100.6), modFOC-Inputs (IC202.3)
NetIC300_2: modFOC-Motion_Controller (IC_100.33), modFOC-ABNenc (IC300.2)
NetIC300_5: modFOC-Motion_Controller (IC_100.34), modFOC-ABNenc (IC300.5)
NetIC300_7: modFOC-Motion_Controller (IC_100.35), modFOC-ABNenc (IC300.7)
NetIC301_2: modFOC-Motion_Controller (IC_100.66), modFOC-ABNenc (IC301.2)
NetIC301_5: modFOC-Motion_Controller (IC_100.65), modFOC-ABNenc (IC301.5)
NetIC301_7: modFOC-Motion_Controller (IC_100.64), modFOC-ABNenc (IC301.7)
NetIC500_4: modFOC-GateDrivers (IC500.4), modFOC-H_Bridges (Q600.4)
NetIC500_7: modFOC-Motion_Controller (IC_100.39), modFOC-GateDrivers (IC500.7)
NetIC500_8: modFOC-Motion_Controller (IC_100.40), modFOC-GateDrivers (IC500.8)
NetIC500_10: modFOC-GateDrivers (IC500.10), modFOC-H_Bridges (Q608.4)
NetIC501_4: modFOC-GateDrivers (IC501.4), modFOC-H_Bridges (Q602.4)
NetIC501_7: modFOC-Motion_Controller (IC_100.41), modFOC-GateDrivers (IC501.7)
NetIC501_8: modFOC-Motion_Controller (IC_100.42), modFOC-GateDrivers (IC501.8)
NetIC501_10: modFOC-GateDrivers (IC501.10), modFOC-H_Bridges (Q610.4)
NetIC502_4: modFOC-GateDrivers (IC502.4), modFOC-H_Bridges (Q604.4)
NetIC502_7: modFOC-Motion_Controller (IC_100.46), modFOC-GateDrivers (IC502.7)
NetIC502_8: modFOC-Motion_Controller (IC_100.47), modFOC-GateDrivers (IC502.8)
NetIC502_10: modFOC-GateDrivers (IC502.10), modFOC-H_Bridges (Q612.4)
NetIC503_4: modFOC-GateDrivers (IC503.4), modFOC-H_Bridges (Q606.4)
NetIC503_7: modFOC-Motion_Controller (IC_100.48), modFOC-GateDrivers (IC503.7)
NetIC503_8: modFOC-Motion_Controller (IC_100.49), modFOC-GateDrivers (IC503.8)
NetIC503_10: modFOC-GateDrivers (IC503.10), modFOC-H_Bridges (Q614.4)
RS1_neg: modFOC-H_Bridges (RS600.1), modFOC-Sensing (IC400.3)
RS1_pos: modFOC-H_Bridges (RS600.4), modFOC-Sensing (IC400.2)
RS2_neg: modFOC-H_Bridges (RS601.4), modFOC-Sensing (IC401.2)
RS2_pos: modFOC-H_Bridges (RS601.1), modFOC-Sensing (IC401.3)
SPI.MISO: modFOC-Motion_Controller (IC_100.9), modFOC-Inputs (D200.4 D202.1 R209.2 R216.1)
SPI.MOSI: modFOC-Motion_Controller (IC_100.8), modFOC-Inputs (D200.6 D202.6 R208.2 R215.1)
SPI.SCK: modFOC-Motion_Controller (IC_100.7), modFOC-Inputs (D200.1 D202.4 R207.2 R214.1)
STATUS: modFOC-Motion_Controller (IC_100.12), modFOC-Sensing (R406.1)
TMC_RST: modFOC-Motion_Controller (R104.2), modFOC-Inputs (IC201.7)
UART.RX: modFOC-Motion_Controller (IC_100.10), modFOC-Inputs (D202.3 R220.2)